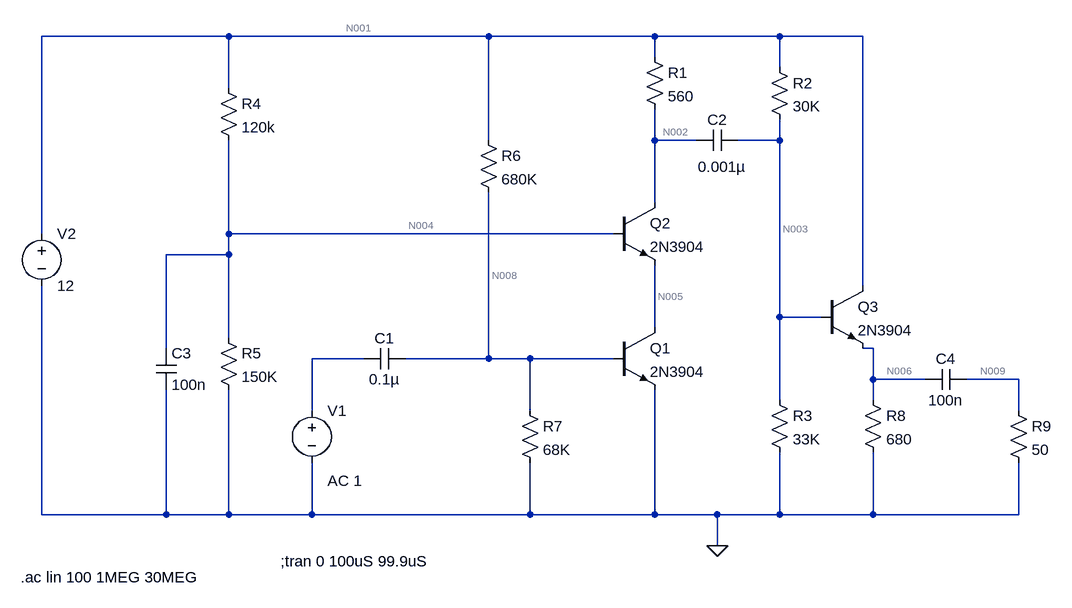
[diagram p0: schematic CascodeAmp.asc]
CascodeAmp.asc, the LTspice schematic file:
Version 4
SHEET 1 980 680
WIRE -416 -432 -704 -432
WIRE -16 -432 -416 -432
WIRE 240 -432 -16 -432
WIRE 432 -432 240 -432
WIRE 560 -432 432 -432
WIRE 240 -400 240 -432
WIRE 432 -384 432 -432
WIRE -416 -352 -416 -432
WIRE -16 -272 -16 -432
WIRE 240 -272 240 -320
WIRE 304 -272 240 -272
WIRE 432 -272 432 -304
WIRE 432 -272 368 -272
WIRE 240 -176 240 -272
WIRE -704 -128 -704 -432
WIRE -416 -128 -416 -272
WIRE 176 -128 -416 -128
WIRE -416 -96 -416 -128
WIRE -416 -96 -512 -96
WIRE 560 -48 560 -432
WIRE 432 0 432 -272
WIRE 496 0 432 0
WIRE 240 16 240 -80
WIRE -416 32 -416 -96
WIRE -512 48 -512 -96
WIRE 576 48 560 48
WIRE -208 64 -288 64
WIRE -16 64 -16 -192
WIRE -16 64 -144 64
WIRE 48 64 -16 64
WIRE 176 64 48 64
WIRE 576 96 576 48
WIRE 656 96 576 96
WIRE 800 96 720 96
WIRE 432 128 432 0
WIRE 576 128 576 96
WIRE -288 144 -288 64
WIRE 48 144 48 64
WIRE 800 144 800 96
WIRE -704 304 -704 -48
WIRE -512 304 -512 112
WIRE -512 304 -704 304
WIRE -416 304 -416 112
WIRE -416 304 -512 304
WIRE -288 304 -288 224
WIRE -288 304 -416 304
WIRE 48 304 48 224
WIRE 48 304 -288 304
WIRE 240 304 240 112
WIRE 240 304 48 304
WIRE 336 304 240 304
WIRE 432 304 432 208
WIRE 432 304 336 304
WIRE 576 304 576 208
WIRE 576 304 432 304
WIRE 800 304 800 224
WIRE 800 304 576 304
WIRE 336 352 336 304
FLAG 336 352 0
SYMBOL npn 176 16 R0
SYMATTR InstName Q1
SYMATTR Value 2N3904
SYMBOL cap -144 48 R90
WINDOW 0 0 32 VBottom 2
WINDOW 3 32 32 VTop 2
SYMATTR InstName C1
SYMATTR Value 0.1µ
SYMBOL res 224 -416 R0
SYMATTR InstName R1
SYMATTR Value 560
SYMBOL voltage -288 128 R0
WINDOW 123 24 124 Left 2
WINDOW 39 0 0 Left 0
SYMATTR Value2 AC 1
SYMATTR InstName V1
SYMATTR Value ""
SYMBOL voltage -704 -144 R0
SYMATTR InstName V2
SYMATTR Value 12
SYMBOL cap 368 -288 R90
WINDOW 0 0 32 VBottom 2
WINDOW 3 41 25 VTop 2
SYMATTR InstName C2
SYMATTR Value 0.001µ
SYMBOL npn 176 -176 R0
SYMATTR InstName Q2
SYMATTR Value 2N3904
SYMBOL res -432 -368 R0
SYMATTR InstName R4
SYMATTR Value 120k
SYMBOL res -432 16 R0
SYMATTR InstName R5
SYMATTR Value 150K
SYMBOL res -32 -288 R0
SYMATTR InstName R6
SYMATTR Value 680K
SYMBOL res 32 128 R0
SYMATTR InstName R7
SYMATTR Value 68K
SYMBOL cap -528 48 R0
SYMATTR InstName C3
SYMATTR Value 100n
SYMBOL npn 496 -48 R0
SYMATTR InstName Q3
SYMATTR Value 2N3904
SYMBOL res 416 -400 R0
SYMATTR InstName R2
SYMATTR Value 30K
SYMBOL res 416 112 R0
SYMATTR InstName R3
SYMATTR Value 33K
SYMBOL res 560 112 R0
SYMATTR InstName R8
SYMATTR Value 680
SYMBOL cap 720 80 R90
WINDOW 0 0 32 VBottom 2
WINDOW 3 32 32 VTop 2
SYMATTR InstName C4
SYMATTR Value 100n
SYMBOL res 784 128 R0
SYMATTR InstName R9
SYMATTR Value 50
TEXT -336 376 Left 2 !;tran 0 100uS 99.9uS
TEXT -736 400 Left 2 !.ac lin 100 1MEG 30MEG

The netlist it stands for:
* CascodeAmp.asc
Q1 N005 N008 0 0 2N3904
C1 N008 N007 0.1µ
R1 N001 N002 560
V1 N007 0 AC 1
V2 N001 0 12
C2 N003 N002 0.001µ
Q2 N002 N004 N005 0 2N3904
R4 N001 N004 120k
R5 N004 0 150K
R6 N001 N008 680K
R7 N008 0 68K
C3 N004 0 100n
Q3 N001 N003 N006 0 2N3904
R2 N001 N003 30K
R3 N003 0 33K
R8 N006 0 680
C4 N009 N006 100n
R9 N009 0 50
.model NPN NPN
.model PNP PNP
.lib standard.bjt
;tran 0 100uS 99.9uS
.ac lin 100 1MEG 30MEG
.backanno
.end

* Results of the author's LTspice run, read from the files saved beside the schematic
* Operating Point, zero values left out:
*   V(n005) = 5.543 V
*   V(n008) = 673.7 mV
*   V(n001) = 12 V
*   V(n002) = 10.82 V
*   V(n003) = 5.903 V
*   V(n004) = 6.217 V
*   V(n006) = 5.195 V
*   Ic(Q3) = 7.616 mA
*   Ib(Q3) = 24.36 µA
*   Ie(Q3) = -7.64 mA
*   Ic(Q2) = 2.106 mA
*   Ib(Q2) = 6.744 µA
*   Ie(Q2) = -2.113 mA
*   Ic(Q1) = 2.113 mA
*   Ib(Q1) = 6.749 µA
*   Ie(Q1) = -2.119 mA
*   I(R8) = 7.64 mA
*   I(R3) = 178.9 µA
*   I(R2) = 203.2 µA
*   I(R7) = 9.908 µA
*   I(R6) = 16.66 µA
*   I(R5) = 41.45 µA
*   I(R4) = 48.19 µA
*   I(R1) = 2.106 mA
*   I(V2) = -9.99 mA
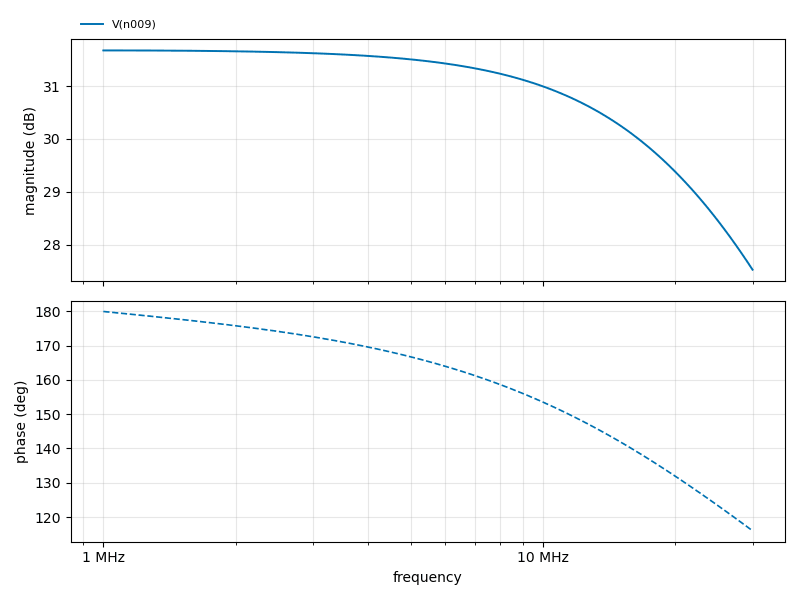
[diagram p1: AC Analysis of CascodeAmp.asc, plotted from the saved traces]
* AC Analysis, 1 run:
*   V(n009): 31.67 dB at 1 MHz, 27.53 dB at 30 MHz, peak 31.67 dB at 1 MHz, 3 dB below the peak at 23.9 MHz